# Altium schematic sheet Canal-DDS.V03.R00.SchDoc: Generador de Señal Canal X
size A4; SheetNumber: 3; SheetTotal: 18
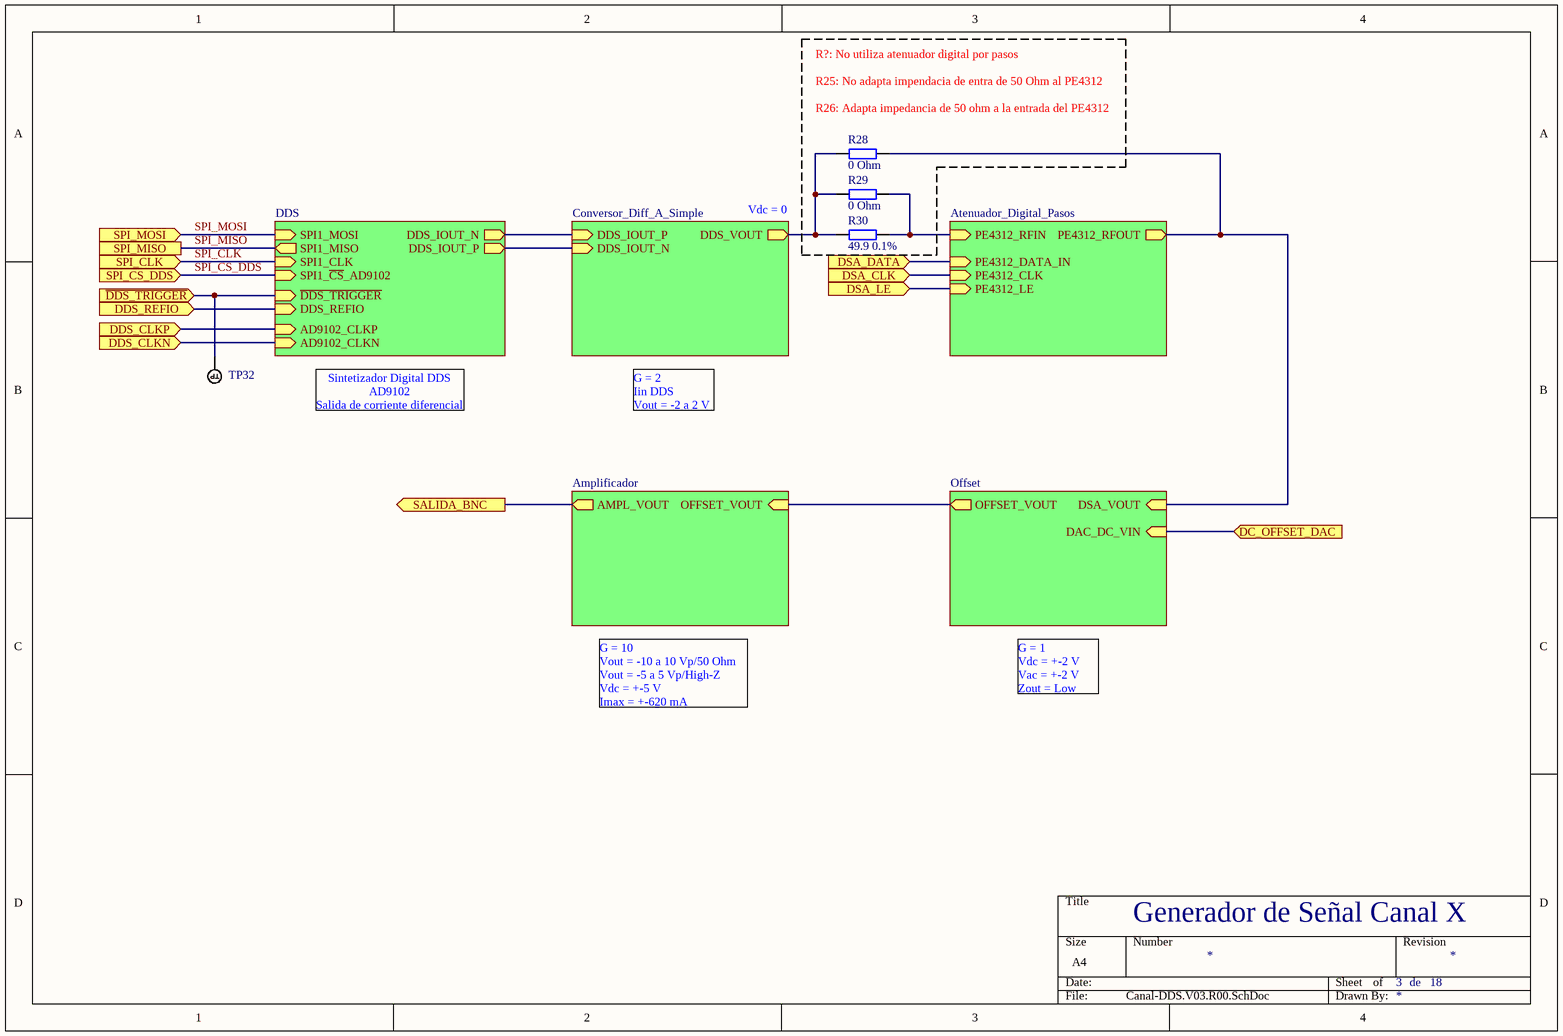
[diagram p0: Canal-DDS.V03.R00.SchDoc]

## Parts
R28  0 Ohm  [RES_0805]
R29  0 Ohm  [RES_0805]
R30  49.9 0.1%  [RES_0805]
TP32  TP_NOBOM  [PAD_RND_1MM]  (value not drawn)  (no BOM)

## Sub-sheets
Amplificador = Amplificador.V03.R00.SchDoc: OFFSET_VOUT (in), AMPL_VOUT (out)
Atenuador_Digital_Pasos = PE4312.V03.R00.SchDoc: PE4312_DATA_IN (in), PE4312_RFIN (in), PE4312_CLK (in), PE4312_LE (in), PE4312_RFOUT (out)
Conversor_Diff_A_Simple = DifferentialToSingleOutput.V03.R00.SchDoc: DDS_IOUT_P (in), DDS_IOUT_N (in), DDS_VOUT (out)
DDS = Sintetizador-AD9102.V03.R00.SchDoc: SPI1_CLK (in), SPI1_MOSI (in), SPI1_MISO (out), SPI1_~{CS}_AD9102 (in), DDS_IOUT_N (out), DDS_IOUT_P (out), AD9102_CLKP (in), AD9102_CLKN (in), ~{DDS_TRIGGER} (in), DDS_REFIO (in)
Offset = Offset.V03.R00.SchDoc: OFFSET_VOUT (out), DAC_DC_VIN (in), DSA_VOUT (in)

## Ports
DC_OFFSET_DAC (in), DDS_CLKN (in), DDS_CLKP (in), DDS_REFIO (in), DSA_CLK (in), DSA_DATA (in), DSA_LE (in), SALIDA_BNC (out), SPI_CLK (in), SPI_CS_DDS (in), SPI_MISO, SPI_MOSI (in), ~{DDS_TRIGGER} (in)

## Nets
~{DDS_TRIGGER}: TP32.1(TP) ; port ~{DDS_TRIGGER}, sheet DDS/~{DDS_TRIGGER}
DC_OFFSET_DAC: port DC_OFFSET_DAC, sheet Offset/DAC_DC_VIN
DDS_CLKN: port DDS_CLKN, sheet DDS/AD9102_CLKN
DDS_CLKP: port DDS_CLKP, sheet DDS/AD9102_CLKP
DDS_REFIO: port DDS_REFIO, sheet DDS/DDS_REFIO
DSA_CLK: port DSA_CLK, sheet Atenuador_Digital_Pasos/PE4312_CLK
DSA_DATA: port DSA_DATA, sheet Atenuador_Digital_Pasos/PE4312_DATA_IN
DSA_LE: port DSA_LE, sheet Atenuador_Digital_Pasos/PE4312_LE
SALIDA_BNC: port SALIDA_BNC, sheet Amplificador/AMPL_VOUT
SPI_CLK: port SPI_CLK, sheet DDS/SPI1_CLK
SPI_CS_DDS: port SPI_CS_DDS, sheet DDS/SPI1_~{CS}_AD9102
SPI_MISO: port SPI_MISO, sheet DDS/SPI1_MISO
SPI_MOSI: port SPI_MOSI, sheet DDS/SPI1_MOSI
NetR28_1: R28.1 R29.1 R30.1 ; sheet Conversor_Diff_A_Simple/DDS_VOUT
NetR28_2: R28.2 ; sheet Atenuador_Digital_Pasos/PE4312_RFOUT, sheet Offset/DSA_VOUT
NetR29_2: R29.2 R30.2 ; sheet Atenuador_Digital_Pasos/PE4312_RFIN
(unnamed): sheet DDS/DDS_IOUT_N, sheet Conversor_Diff_A_Simple/DDS_IOUT_P
(unnamed): sheet DDS/DDS_IOUT_P, sheet Conversor_Diff_A_Simple/DDS_IOUT_N
(unnamed): sheet Offset/OFFSET_VOUT, sheet Amplificador/OFFSET_VOUT

## Notes on the sheet
- (near R28) R?: No utiliza atenuador digital por pasos
  R25: No adapta impendacia de entra de 50 Ohm al PE4312
  R26: Adapta impedancia de 50 ohm a la entrada del PE4312
- Vdc = 0
- Sintetizador Digital DDS AD9102
  Salida de corriente diferencial
- G = 2
  Iin DDS
  Vout = -2 a 2 V
- G = 10
  Vout = -10 a 10 Vp/50 Ohm
  Vout = -5 a 5 Vp/High-Z
  Vdc = +-5 V
  Imax = +-620 mA
- G = 1
  Vdc = +-2 V
  Vac = +-2 V
  Zout = Low
- de

## Library data of the parts
R28-R30 = RES_0805: Resistor SMD 0805; Manufacturer: *; Manufacturer Part Number: *; Distributor Link: *; LCSC: *
TP32 = TEST_POINT_RND_1MM: Test Point Round 1mm (NO BOM)